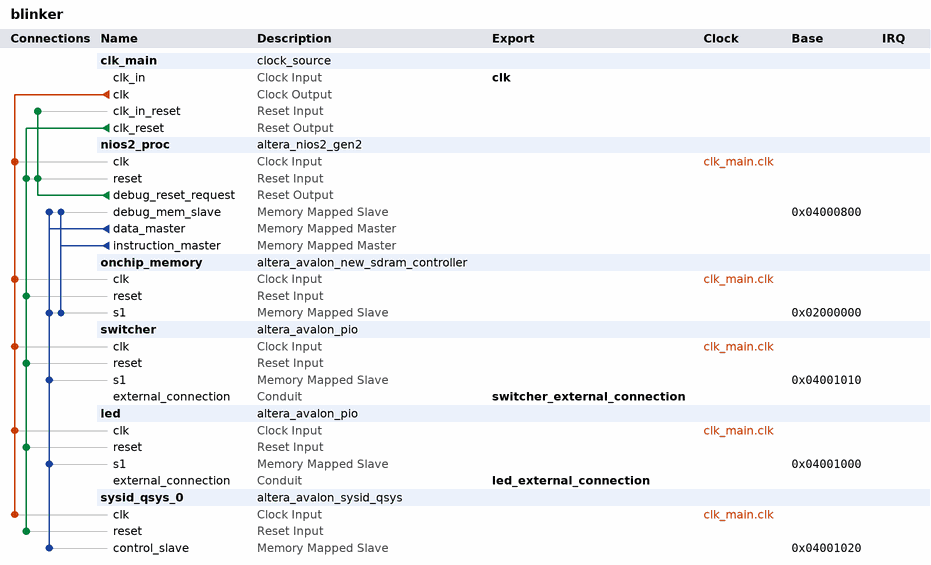
[diagram p0: system contents]
# Platform Designer (Qsys) system blinker, Cyclone V 5CGXFC5C6F27C7
# Parameters at their usual value, and those the tool derives, are not listed.
package require -exact qsys 15.0
create_system blinker
set_project_property DEVICE_FAMILY {Cyclone V}
set_project_property DEVICE 5CGXFC5C6F27C7

add_instance clk_main clock_source 15.0
set_instance_parameter_value clk_main clockFrequency 50000000

add_instance nios2_proc altera_nios2_gen2 15.0
set_instance_parameter_value nios2_proc dcache_size 2048
set_instance_parameter_value nios2_proc exceptionSlave onchip_memory.s1
set_instance_parameter_value nios2_proc icache_size 4096
set_instance_parameter_value nios2_proc impl Fast
set_instance_parameter_value nios2_proc resetSlave onchip_memory.s1

add_instance onchip_memory altera_avalon_new_sdram_controller 15.0
set_instance_parameter_value onchip_memory TAC 5.4
set_instance_parameter_value onchip_memory TRCD 20.0
set_instance_parameter_value onchip_memory TRP 20.0
set_instance_parameter_value onchip_memory casLatency 2
set_instance_parameter_value onchip_memory columnWidth 8
set_instance_parameter_value onchip_memory dataWidth 64
set_instance_parameter_value onchip_memory generateSimulationModel false
set_instance_parameter_value onchip_memory model single_Micron_MT48LC4M32B2_7_chip
set_instance_parameter_value onchip_memory numberOfBanks 4
set_instance_parameter_value onchip_memory numberOfChipSelects 1
set_instance_parameter_value onchip_memory powerUpDelay 100.0
set_instance_parameter_value onchip_memory refreshPeriod 15.625
set_instance_parameter_value onchip_memory rowWidth 12

add_instance switcher altera_avalon_pio 15.0
set_instance_parameter_value switcher direction Input
set_instance_parameter_value switcher width 8

add_instance led altera_avalon_pio 15.0
set_instance_parameter_value led direction Output
set_instance_parameter_value led width 8

add_instance sysid_qsys_0 altera_avalon_sysid_qsys 15.0
set_instance_parameter_value sysid_qsys_0 id 4919

# connections
add_connection clk_main.clk led.clk clock
add_connection clk_main.clk nios2_proc.clk clock
add_connection clk_main.clk onchip_memory.clk clock
add_connection clk_main.clk switcher.clk clock
add_connection clk_main.clk sysid_qsys_0.clk clock
add_connection clk_main.clk_reset led.reset reset
add_connection clk_main.clk_reset nios2_proc.reset reset
add_connection clk_main.clk_reset onchip_memory.reset reset
add_connection clk_main.clk_reset switcher.reset reset
add_connection clk_main.clk_reset sysid_qsys_0.reset reset
add_connection nios2_proc.debug_reset_request clk_main.clk_in_reset reset
add_connection nios2_proc.debug_reset_request nios2_proc.reset reset
add_connection nios2_proc.data_master led.s1 avalon
set_connection_parameter_value nios2_proc.data_master/led.s1 baseAddress 0x04001000
add_connection nios2_proc.data_master nios2_proc.debug_mem_slave avalon
set_connection_parameter_value nios2_proc.data_master/nios2_proc.debug_mem_slave baseAddress 0x04000800
add_connection nios2_proc.data_master onchip_memory.s1 avalon
set_connection_parameter_value nios2_proc.data_master/onchip_memory.s1 baseAddress 0x02000000
add_connection nios2_proc.data_master switcher.s1 avalon
set_connection_parameter_value nios2_proc.data_master/switcher.s1 baseAddress 0x04001010
add_connection nios2_proc.data_master sysid_qsys_0.control_slave avalon
set_connection_parameter_value nios2_proc.data_master/sysid_qsys_0.control_slave baseAddress 0x04001020
add_connection nios2_proc.instruction_master nios2_proc.debug_mem_slave avalon
set_connection_parameter_value nios2_proc.instruction_master/nios2_proc.debug_mem_slave baseAddress 0x04000800
add_connection nios2_proc.instruction_master onchip_memory.s1 avalon
set_connection_parameter_value nios2_proc.instruction_master/onchip_memory.s1 baseAddress 0x02000000

# exported interfaces
add_interface clk clock sink
set_interface_property clk EXPORT_OF clk_main.clk_in
add_interface led_external_connection conduit end
set_interface_property led_external_connection EXPORT_OF led.external_connection
add_interface switcher_external_connection conduit end
set_interface_property switcher_external_connection EXPORT_OF switcher.external_connection

set_interconnect_requirement {$system} qsys_mm.clockCrossingAdapter HANDSHAKE
set_interconnect_requirement {$system} qsys_mm.enableEccProtection FALSE
set_interconnect_requirement {$system} qsys_mm.insertDefaultSlave FALSE
set_interconnect_requirement {$system} qsys_mm.maxAdditionalLatency 1

save_system blinker.qsys
